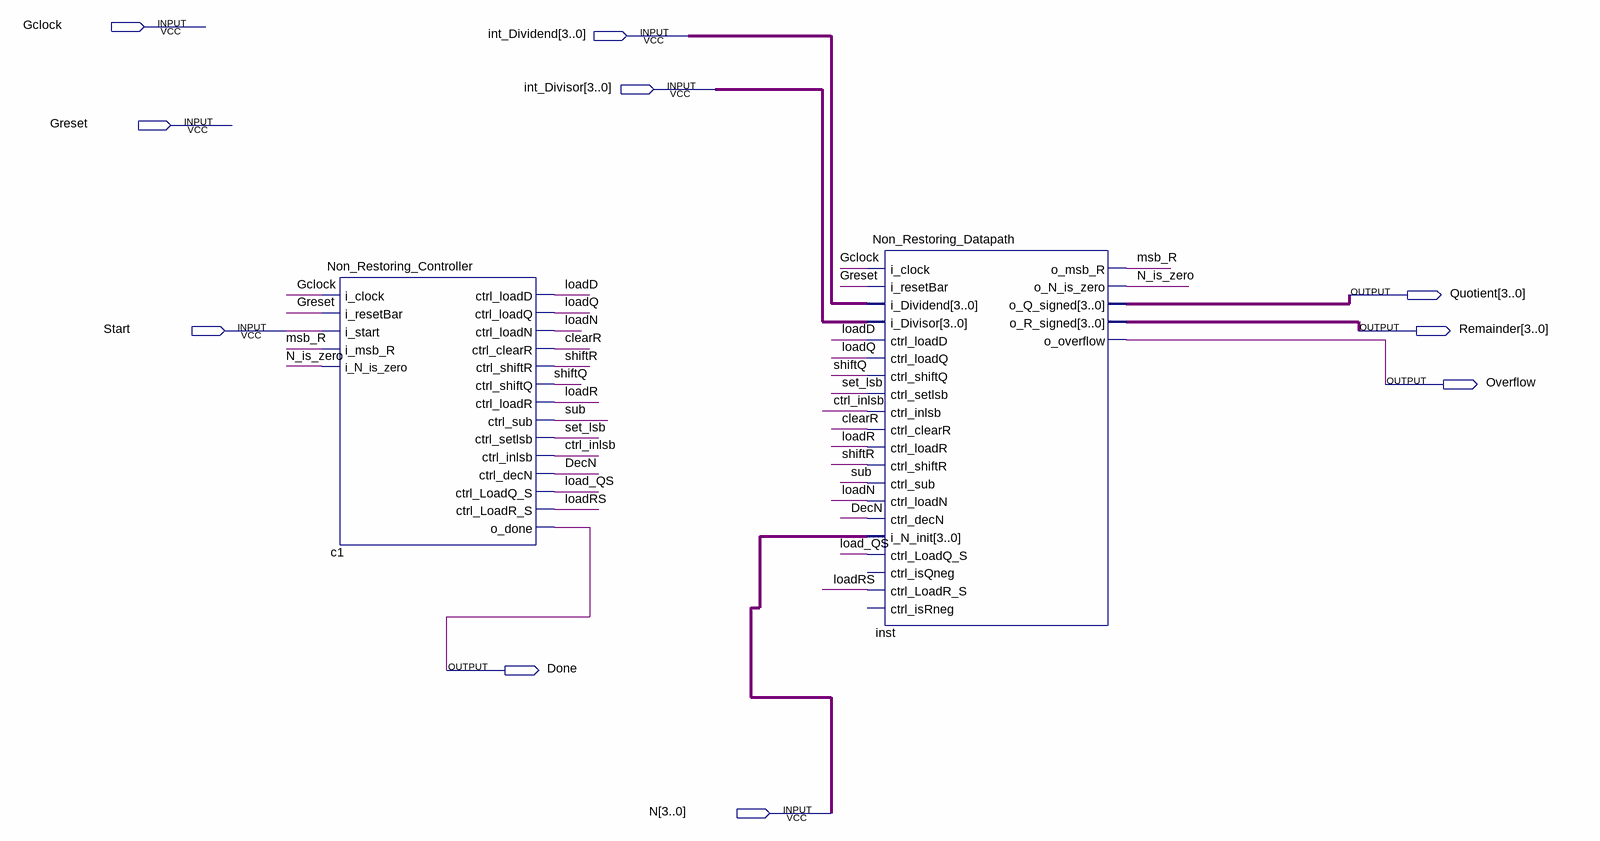
[diagram p0: schematic sheet]
// Quartus schematic Division_non_restoring.bdf as structural Verilog: 2 symbols, 10 pins
module Division_non_restoring (
  input  Gclock,
  input  [3:0] int_Dividend,
  input  [3:0] int_Divisor,
  input  Greset,
  input  Start,
  input  [3:0] N,
  output [3:0] Quotient,
  output [3:0] Remainder,
  output Overflow,
  output Done
);

  wire clearR, ctrl_inlsb, DecN, load_QS, loadD, loadN, loadQ, loadR, loadRS, msb_R, N_is_zero, set_lsb,
       shiftQ, shiftR, sub;

  Non_Restoring_Controller c1 (
    .i_clock(Gclock), .i_resetBar(Greset), .i_start(Start), .i_msb_R(msb_R), .i_N_is_zero(N_is_zero),
    .ctrl_loadD(loadD), .ctrl_loadQ(loadQ), .ctrl_loadN(loadN), .ctrl_clearR(clearR), .ctrl_shiftR(shiftR),
    .ctrl_shiftQ(shiftQ), .ctrl_loadR(loadR), .ctrl_sub(sub), .ctrl_setlsb(set_lsb), .ctrl_inlsb(ctrl_inlsb),
    .ctrl_decN(DecN), .ctrl_LoadQ_S(load_QS), .ctrl_LoadR_S(loadRS), .o_done(Done));
  Non_Restoring_Datapath inst (
    .i_clock(Gclock), .i_resetBar(Greset), .i_Dividend(int_Dividend), .i_Divisor(int_Divisor),
    .ctrl_loadD(loadD), .ctrl_loadQ(loadQ), .ctrl_shiftQ(shiftQ), .ctrl_setlsb(set_lsb),
    .ctrl_inlsb(ctrl_inlsb), .ctrl_clearR(clearR), .ctrl_loadR(loadR), .ctrl_shiftR(shiftR), .ctrl_sub(sub),
    .ctrl_loadN(loadN), .ctrl_decN(DecN), .i_N_init(N), .ctrl_LoadQ_S(load_QS), .ctrl_LoadR_S(loadRS),
    .o_msb_R(msb_R), .o_N_is_zero(N_is_zero), .o_Q_signed(Quotient), .o_R_signed(Remainder),
    .o_overflow(Overflow));  // open: ctrl_isQneg, ctrl_isRneg
endmodule
